# EAGLE board pro-base (EAGLE 9.6.2)
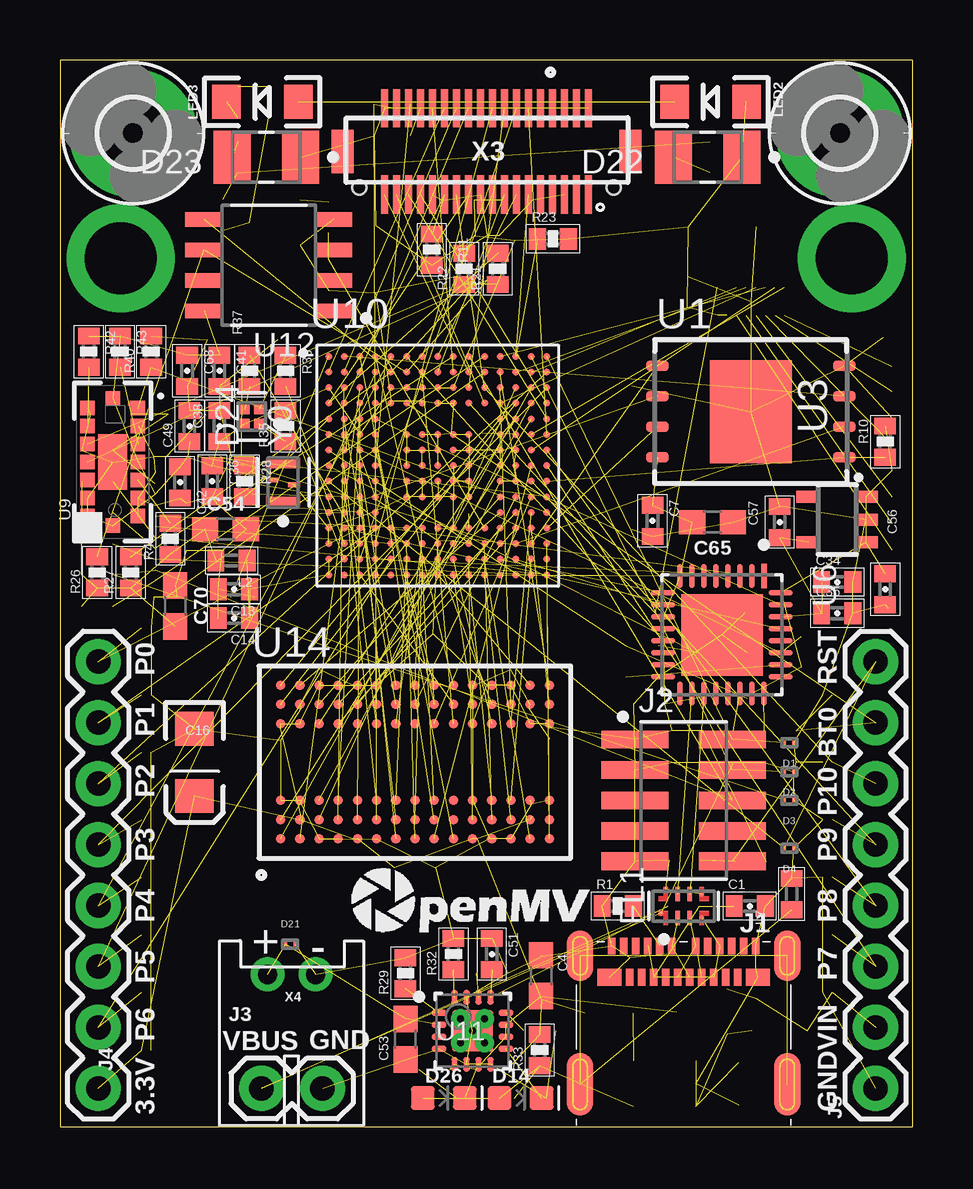
[diagram p2: board, top side]
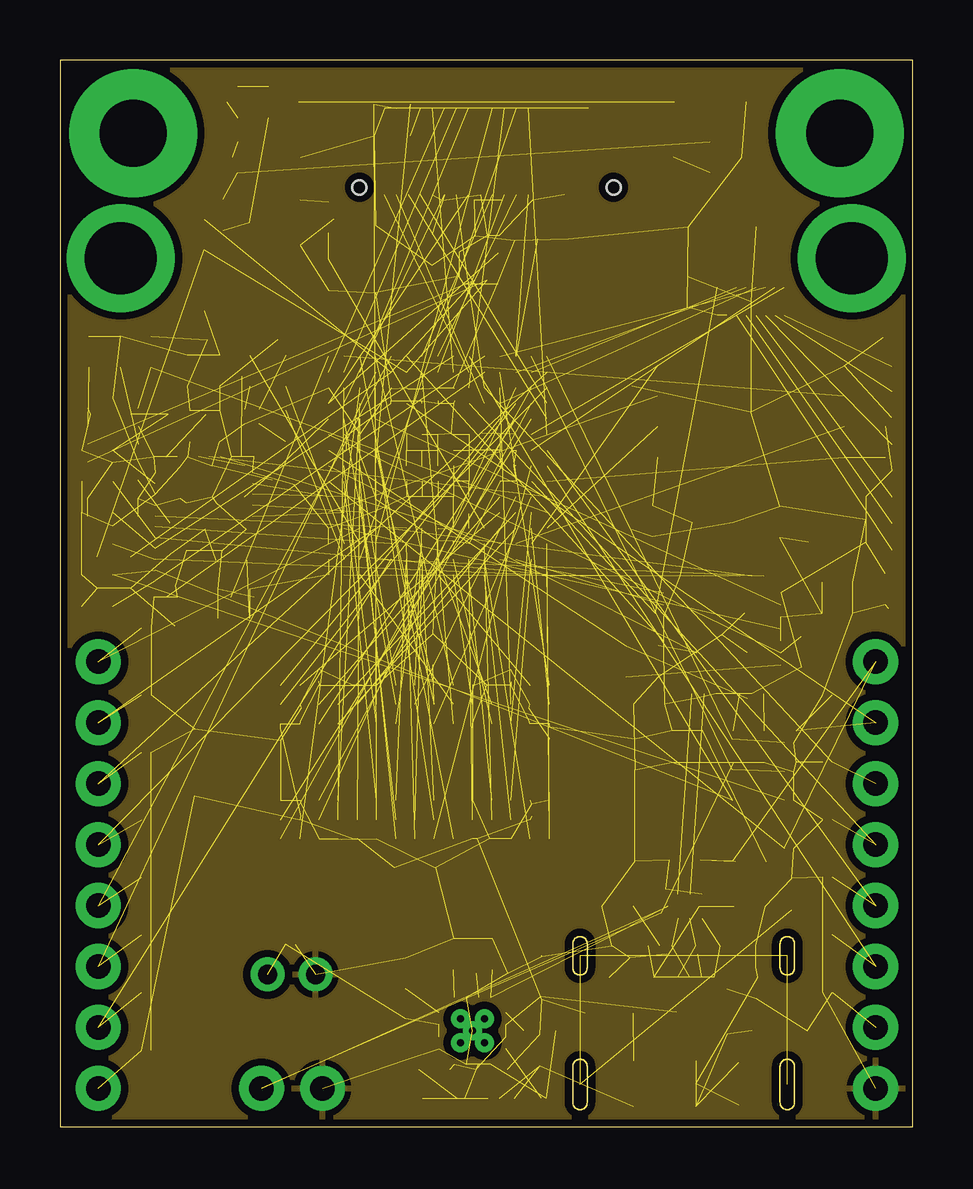
[diagram p3: board, inner layer GND]
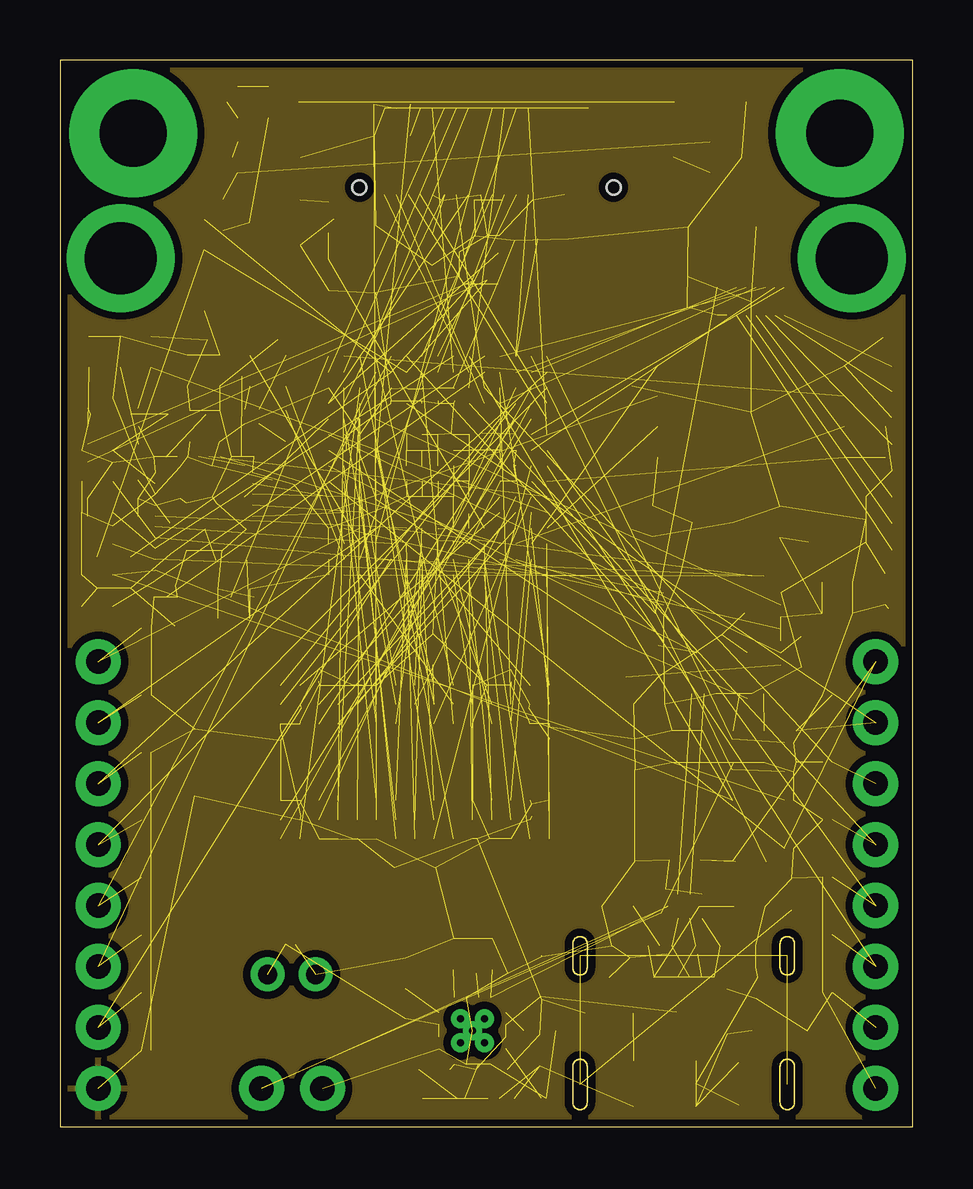
[diagram p4: board, inner layer VCC]
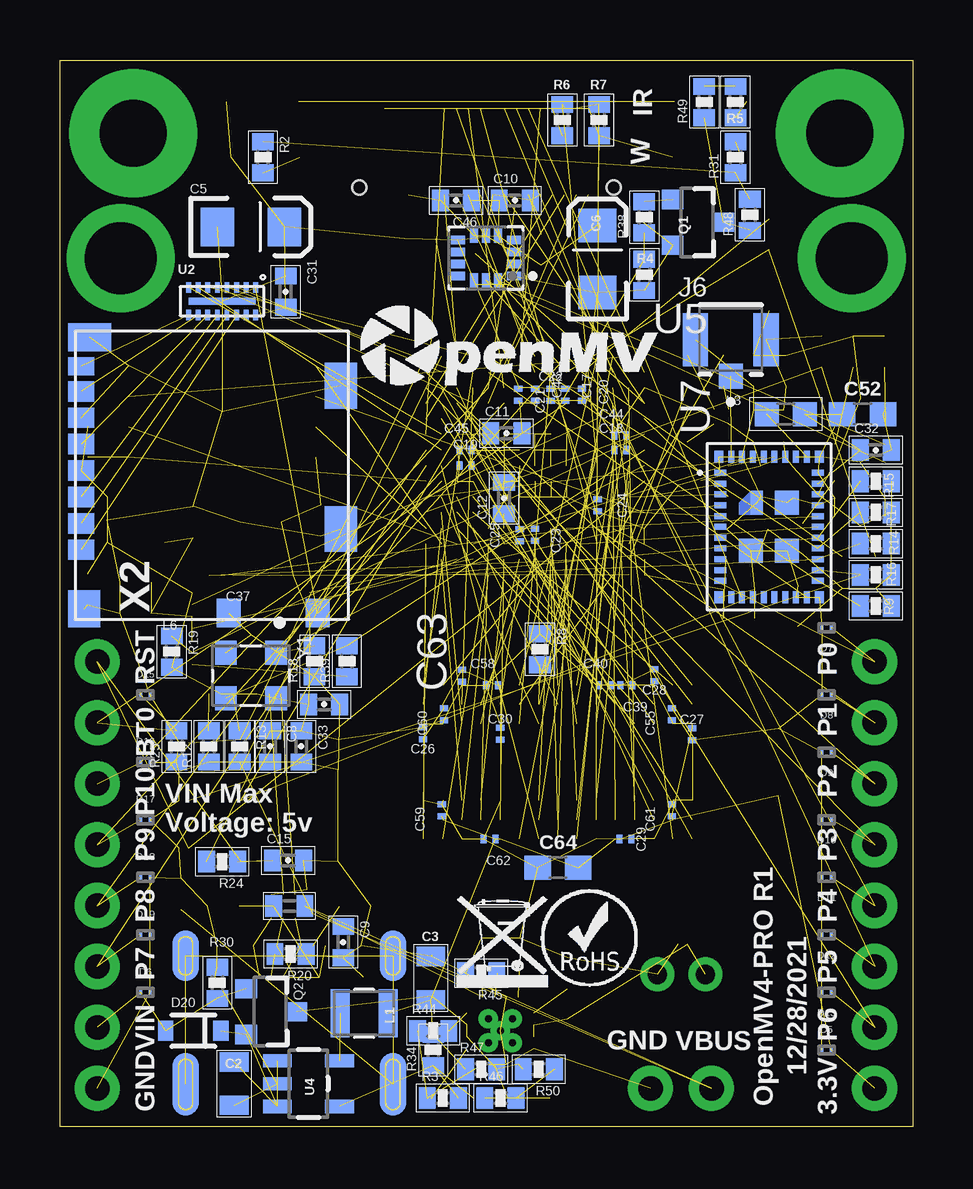
[diagram p5: board, bottom side, seen from below]

Size 35.56 x 44.45 mm. Coordinates in mm from the lower left corner, seen from the top.
Outline: 0,44.45 0,0 35.56,0 35.56,44.45 0,44.45
Copper layers (1+2*3+14*15+16): Top 0.035mm / dielectric 1.5mm / GND 0.035mm / dielectric 0.15mm / Route3 0.035mm / dielectric 0.2mm / Route14 0.035mm / dielectric 0.15mm / VCC 0.035mm / dielectric 0.2mm / Bottom 0.035mm
Design rules "default *": minimum track width 3.5mil, minimum drill 0.2mm, track to track 3.5mil, track to pad 5mil, pad to pad 5mil, via to via 5mil, smd to smd 3.5mil, copper to edge 5mil, drill to drill 10mil, minimum pad ring 10mil, minimum via ring 3mil, stop-mask expansion 2mil, vias tented up to drill 30mil, thermal gap 10mil
Net classes: 1 power: width 0.305 mm; 2 gnd: width 0.254 mm; 3 sdram_data: width 0.089 mm, drill 0.102 mm, clearance 0.089 mm; 4 sdram_cmd: width 0.089 mm, drill 0.102 mm, clearance 0.089 mm; 5 dcmi_data: width 0.089 mm, drill 0.102 mm, clearance 0.089 mm

## Footprints (pad centres in the part's own frame; a part is rotated, then mirrored left to right if it is on the bottom)
0402-CAP = smd 0.7 x 0.9: 1 -0.65,0; 2 0.65,0
0805 = smd 0.8 x 1.2: 1 -0.9,0; 2 0.9,0
0603 = smd 1.1 x 1: 1 -0.85,0; 2 0.85,0
EIA3216 = smd 1.4 x 1.6: A 1.4,0; C -1.4,0
C0201 = smd 0.25 x 0.35: 1 -0.25,0; 2 0.25,0
VISHAY_VCUT05E1-SD0-G4-08_0 = smd 0.14 x 0.24: 1 -0.2,0; 2 0.2,0
LED-0603 = smd 1 x 1: A -0.877,0; C 0.877,0
SOD-323 = smd 0.63 x 0.83: 1 -1.15,0; 2 1.15,0
CREE_CLM3C-WKW-CWBYA453_0 = smd 1.55 x 2.2: 1 -1.425,0; 2 1.425,0
CREE_UHD1110-FKA-CL1A13R3Q1BBQFMF3_0 = smd 0.4 x 0.4: 1 -0.3,0.3; 2 -0.3,-0.3; 3 0.3,-0.3; 4 0.3,0.3
STMICROELECTRONICS_ECMF02-4CMX8_0 = smd 0.18 x 0.18: 1 -0.3,0.95; 4 -0.5,-0.75; 5 0.5,-0.75; 8 0.7,0.75 | smd 0.6 x 0.2: 2 -0.5,0.25; 3 -0.5,-0.25; 6 0.5,-0.25; 7 0.5,0.25
2,8-PAD = drill 2.8 pad 5.334: B2,8 0,0
105450-0101 = smd 0.3 x 0.7: A1 -3,0.41; A2 -2.5,0.41; A3 -2,0.41; A4 -1.5,0.41; A5 -1,0.41; A6 -0.5,0.41; A7 0.5,0.41; A8 1,0.41; A9 1.5,0.41; A10 2,0.41; A11 2.5,0.41; A12 3,0.41; B2 2.25,-0.89; B3 1.75,-0.89; B4 1.25,-0.89; B5 0.75,-0.89; B6 0.25,-0.89; B7 -0.25,-0.89; B8 -0.75,-0.89; B9 -1.25,-0.89; B10 -1.75,-0.89; B11 -2.25,-0.89 | smd 1 x 0.7: B1 3.1,-0.89; B12 -3.1,-0.89 | smd 1.1 x 2.6 bottom: S_B1 -4.32,-5.36; S_B4 4.32,-5.36 | smd 1.1 x 2.1 bottom: S_B2 -4.32,0; S_B3 4.32,0 | smd 1.1 x 2.6: S_T1 -4.32,-5.36; S_T4 4.32,-5.36 | smd 1.1 x 2.1: S_T2 -4.32,0; S_T3 4.32,0
SAMTEC_FTSH-105-01-F-DV_0 = smd 0.74 x 2.79: 1 -2.54,-2.035; 2 -2.54,2.035; 3 -1.27,-2.035; 4 -1.27,2.035; 5 0,-2.035; 6 0,2.035; 7 1.27,-2.035; 8 1.27,2.035; 9 2.54,-2.035; 10 2.54,2.035
1X02 = drill 1.016 pad 1.88: 1 0,0; 2 2.54,0
1X08 = drill 1.016 pad 1.88: 1 0,0; 2 2.54,0; 3 5.08,0; 4 7.62,0; 5 10.16,0; 6 12.7,0; 7 15.24,0; 8 17.78,0
SAMTEC_RSP-122811-01 = smd 1 x 1.05: 1 0,-1.525 | smd 1.05 x 2.2: G1 -1.475,0; G2 1.475,0
1007 = smd 2 x 0.8: 1 0,1; 2 0,-1
C0402 = smd 0.7 x 0.9: 1 -0.65,0; 2 0.65,0
0603' = smd 1 x 1: 1 -0.8,0; 2 0.8,0
LED-1206 = smd 1.2 x 1.4: A -1.5,0; C 1.5,0
9774030151R = drill 3 pad 4.5: P$1 0,0
SOT23-3 = smd 0.8 x 0.9: 1 -0.95,-1; 2 0.95,-1; 3 0,1.1
0402-RES = smd 0.7 x 0.9: 1 -0.65,0; 2 0.65,0
SON127P800X600X80-9N = smd 0.94 x 0.44: 1 -3.895,1.905; 2 -3.895,0.635; 3 -3.895,-0.635; 4 -3.895,-1.905; 5 3.895,-1.905; 6 3.895,-0.635; 7 3.895,0.635; 8 3.895,1.905 | smd 3.4 x 4.3: 9 0,0
QFN3.5 = smd 2.8 x 0.3: GND 0,0 | smd 0.2 x 0.45: P$1 -1.4,-0.575; P$2 -1,-0.575; P$3 -0.6,-0.575; P$4 -0.2,-0.575; P$5 0.2,-0.575; P$6 0.6,-0.575; P$7 1,-0.575; P$8 1.4,-0.575; P$9 1.4,0.575; P$10 1,0.575; P$11 0.6,0.575; P$12 0.2,0.575; P$13 -0.2,0.575; P$14 -0.6,0.575; P$15 -1,0.575; P$16 -1.4,0.575
SOT23-5 = smd 0.5 x 1: 1 -0.95,-1.2; 2 0,-1.2; 3 0.95,-1.2; 4 0.95,1.2; 5 -0.95,1.2
TSOT25 = smd 0.55 x 1.2: 1 -0.95,-1.3; 2 0,-1.3; 3 0.95,-1.3; 4 0.95,1.3; 5 -0.95,1.3
PQFN50P300X250X86-14N = smd 0.58 x 0.35: 1 -1.175,0.75; 2 -1.175,0.25; 3 -1.175,-0.25; 4 -1.175,-0.75; 8 1.175,-0.75; 9 1.175,-0.25; 10 1.175,0.25; 11 1.175,0.75 | smd 0.35 x 0.58: 5 -0.5,-0.925; 6 0,-0.925; 7 0.5,-0.925; 12 0.5,0.925; 13 0,0.925; 14 -0.5,0.925
MICROCHIP_USB3320C-EZK-TR_1 = smd 1.01 x 0.239: 1 -2.451,1.75; 2 -2.451,1.25; 3 -2.451,0.75; 4 -2.451,0.25; 5 -2.451,-0.25; 6 -2.451,-0.75; 7 -2.451,-1.25; 8 -2.451,-1.75; 17 2.451,-1.75; 18 2.451,-1.25; 19 2.451,-0.75; 20 2.451,-0.25; 21 2.451,0.25; 22 2.451,0.75; 23 2.451,1.25; 24 2.451,1.75 | smd 0.239 x 1.01: 9 -1.75,-2.451; 10 -1.25,-2.451; 11 -0.75,-2.451; 12 -0.25,-2.451; 13 0.25,-2.451; 14 0.75,-2.451; 15 1.25,-2.451; 16 1.75,-2.451; 25 1.75,2.451; 26 1.25,2.451; 27 0.75,2.451; 28 0.25,2.451; 29 -0.25,2.451; 30 -0.75,2.451; 31 -1.25,2.451; 32 -1.75,2.451 | smd 3.4 x 3.4: 33 0,0
XCVR_LBEE5KL1DX-TEMP = smd 0.5 x 0.25: 1 -2.025,2.25; 2 -2.025,1.8; 3 -2.025,1.35; 4 -2.025,0.9; 5 -2.025,0.45; 6 -2.025,0; 7 -2.025,-0.45; 8 -2.025,-0.9; 9 -2.025,-1.35; 10 -2.025,-1.8; 11 -2.025,-2.25; 22 2.025,-2.25; 23 2.025,-1.8; 24 2.025,-1.35; 25 2.025,-0.9; 26 2.025,-0.45; 27 2.025,0; 28 2.025,0.45; 29 2.025,0.9; 30 2.025,1.35; 31 2.025,1.8; 32 2.025,2.25 | smd 0.375 x 0.5: 12 -2.087,-2.925; 21 2.087,-2.925; 33 2.087,2.925; 42 -2.087,2.925 | smd 0.25 x 0.5: 13 -1.575,-2.925; 14 -1.125,-2.925; 15 -0.675,-2.925; 16 -0.225,-2.925; 17 0.225,-2.925; 18 0.675,-2.925; 19 1.125,-2.925; 20 1.575,-2.925; 34 1.575,2.925; 35 1.125,2.925; 36 0.675,2.925; 37 0.225,2.925; 38 -0.225,2.925; 39 -0.675,2.925; 40 -1.125,2.925; 41 -1.575,2.925 | smd 0.5 x 1: 43 -0.5,1 | smd 1 x 1: 44 -0.75,-1; 45 0.75,1; 46 0.75,-1
VL53L5CX = smd 0.6 x 0.6: A1 2.25,-1.05; A2 1.5,-1.05; A3 0.75,-1.05; A4 0,-1.05; A5 -0.75,-1.05; A6 -1.5,-1.05; A7 -2.25,-1.05; B1 2.65,0; B7 -2.65,0; C1 2.25,1.05; C2 1.5,1.05; C3 0.75,1.05; C4 0,1.05; C5 -0.75,1.05; C6 -1.5,1.05; C7 -2.25,1.05 | smd 2.316 x 1.2: B4 0,0
UFGBGA-176 = smd 0.3 x 0.3: A1 -4.55,4.55; A2 -3.9,4.55; A3 -3.25,4.55; A4 -2.6,4.55; A5 -1.95,4.55; A6 -1.3,4.55; A7 -0.65,4.55; A8 0,4.55; A9 0.65,4.55; A10 1.3,4.55; A11 1.95,4.55; A12 2.6,4.55; A13 3.25,4.55; A14 3.9,4.55; A15 4.55,4.55; B1 -4.55,3.9; B2 -3.9,3.9; B3 -3.25,3.9; B4 -2.6,3.9; B5 -1.95,3.9; B6 -1.3,3.9; B7 -0.65,3.9; B8 0,3.9; B9 0.65,3.9; B10 1.3,3.9; B11 1.95,3.9; B12 2.6,3.9; B13 3.25,3.9; B14 3.9,3.9; B15 4.55,3.9; C1 -4.55,3.25; C2 -3.9,3.25; C3 -3.25,3.25; C4 -2.6,3.25; C5 -1.95,3.25; C6 -1.3,3.25; C7 -0.65,3.25; C8 0,3.25; C9 0.65,3.25; C10 1.3,3.25; C11 1.95,3.25; C12 2.6,3.25; C13 3.25,3.25; C14 3.9,3.25; C15 4.55,3.25; D1 -4.55,2.6; D2 -3.9,2.6; D3 -3.25,2.6; D4 -2.6,2.6; D5 -1.95,2.6; D6 -1.3,2.6; D7 -0.65,2.6; D8 0,2.6; D9 0.65,2.6; D10 1.3,2.6; D11 1.95,2.6; D12 2.6,2.6; D13 3.25,2.6; D14 3.9,2.6; D15 4.55,2.6; E1 -4.55,1.95; E2 -3.9,1.95; E3 -3.25,1.95; E4 -2.6,1.95; E12 2.6,1.95; E13 3.25,1.95; E14 3.9,1.95; E15 4.55,1.95; F1 -4.55,1.3; F2 -3.9,1.3; F3 -3.25,1.3; F4 -2.6,1.3; F6 -1.3,1.3; F7 -0.65,1.3; F8 0,1.3; F9 0.65,1.3; F10 1.3,1.3; F12 2.6,1.3; F13 3.25,1.3; F14 3.9,1.3; F15 4.55,1.3; G1 -4.55,0.65; G2 -3.9,0.65; G3 -3.25,0.65; G4 -2.6,0.65; G6 -1.3,0.65; G7 -0.65,0.65; G8 0,0.65; G9 0.65,0.65; G10 1.3,0.65; G12 2.6,0.65; G13 3.25,0.65; G14 3.9,0.65; G15 4.55,0.65; H1 -4.55,0; H2 -3.9,0; H3 -3.25,0; H4 -2.6,0; H6 -1.3,0; H7 -0.65,0; H8 0,0; H9 0.65,0; H10 1.3,0; H12 2.6,0; H13 3.25,0; H14 3.9,0; H15 4.55,0; J1 -4.55,-0.65; J2 -3.9,-0.65; J3 -3.25,-0.65; J4 -2.6,-0.65; J6 -1.3,-0.65; J7 -0.65,-0.65; J8 0,-0.65; J9 0.65,-0.65; J10 1.3,-0.65; J12 2.6,-0.65; J13 3.25,-0.65; J14 3.9,-0.65; J15 4.55,-0.65; K1 -4.55,-1.3; K2 -3.9,-1.3; K3 -3.25,-1.3; K4 -2.6,-1.3; K6 -1.3,-1.3; K7 -0.65,-1.3; K8 0,-1.3; K9 0.65,-1.3; K10 1.3,-1.3; K12 2.6,-1.3; K13 3.25,-1.3; K14 3.9,-1.3; K15 4.55,-1.3; L1 -4.55,-1.95; L2 -3.9,-1.95; L3 -3.25,-1.95; L4 -2.6,-1.95; L12 2.6,-1.95; L13 3.25,-1.95; L14 3.9,-1.95; L15 4.55,-1.95; M1 -4.55,-2.6; M2 -3.9,-2.6; M3 -3.25,-2.6; M4 -2.6,-2.6; M5 -1.95,-2.6; M6 -1.3,-2.6; M7 -0.65,-2.6; M8 0,-2.6; M9 0.65,-2.6; M10 1.3,-2.6; M11 1.95,-2.6; M12 2.6,-2.6; M13 3.25,-2.6; M14 3.9,-2.6; M15 4.55,-2.6; N1 -4.55,-3.25; N2 -3.9,-3.25; N3 -3.25,-3.25; N4 -2.6,-3.25; N5 -1.95,-3.25; N6 -1.3,-3.25; N7 -0.65,-3.25; N8 0,-3.25; N9 0.65,-3.25; N10 1.3,-3.25; N11 1.95,-3.25; N12 2.6,-3.25; N13 3.25,-3.25; N14 3.9,-3.25; N15 4.55,-3.25; P1 -4.55,-3.9; P2 -3.9,-3.9; P3 -3.25,-3.9; P4 -2.6,-3.9; P5 -1.95,-3.9; P6 -1.3,-3.9; P7 -0.65,-3.9; P8 0,-3.9; P9 0.65,-3.9; P10 1.3,-3.9; P11 1.95,-3.9; P12 2.6,-3.9; P13 3.25,-3.9; P14 3.9,-3.9; P15 4.55,-3.9; R1 -4.55,-4.55; R2 -3.9,-4.55; R3 -3.25,-4.55; R4 -2.6,-4.55; R5 -1.95,-4.55; R6 -1.3,-4.55; R7 -0.65,-4.55; R8 0,-4.55; R9 0.65,-4.55; R10 1.3,-4.55; R11 1.95,-4.55; R12 2.6,-4.55; R13 3.25,-4.55; R14 3.9,-4.55; R15 4.55,-4.55
TEXAS_INSTRUMENTS_BQ24072TRGTR_0 = smd 0.6 x 0.25: 1 -1.4,0.75; 2 -1.4,0.25; 3 -1.4,-0.25; 4 -1.4,-0.75; 9 1.4,-0.75; 10 1.4,-0.25; 11 1.4,0.25; 12 1.4,0.75 | smd 0.25 x 0.6: 5 -0.75,-1.4; 6 -0.25,-1.4; 7 0.25,-1.4; 8 0.75,-1.4; 13 0.75,1.4; 14 0.25,1.4; 15 -0.25,1.4; 16 -0.75,1.4 | smd 1.7 x 1.7: 17 0,0 | smd 1.55 x 1.55: 17-2 0,0 | drill 0.3 pad 0.5: PAD_1 0,0; PAD_2 0.5,-0.5; PAD_3 0.5,0.5; PAD_4 -0.5,0.5; PAD_5 -0.5,-0.5
MICROCHIP_ATECC608A-SSHDA-B_0 = smd 1.55 x 0.6: 1 -2.7,1.905; 2 -2.7,0.635; 3 -2.7,-0.635; 4 -2.7,-1.905; 5 2.7,-1.905; 6 2.7,-0.635; 7 2.7,0.635; 8 2.7,1.905
BGA90 = smd 0.4 x 0.4: A1 -3.2,5.6; A2 -2.4,5.6; A3 -1.6,5.6; A7 1.6,5.6; A8 2.4,5.6; A9 3.2,5.6; B1 -3.2,4.8; B2 -2.4,4.8; B3 -1.6,4.8; B7 1.6,4.8; B8 2.4,4.8; B9 3.2,4.8; C1 -3.2,4; C2 -2.4,4; C3 -1.6,4; C7 1.6,4; C8 2.4,4; C9 3.2,4; D1 -3.2,3.2; D2 -2.4,3.2; D3 -1.6,3.2; D7 1.6,3.2; D8 2.4,3.2; D9 3.2,3.2; E1 -3.2,2.4; E2 -2.4,2.4; E3 -1.6,2.4; E7 1.6,2.4; E8 2.4,2.4; E9 3.2,2.4; F1 -3.2,1.6; F2 -2.4,1.6; F3 -1.6,1.6; F7 1.6,1.6; F8 2.4,1.6; F9 3.2,1.6; G1 -3.2,0.8; G2 -2.4,0.8; G3 -1.6,0.8; G7 1.6,0.8; G8 2.4,0.8; G9 3.2,0.8; H1 -3.2,0; H2 -2.4,0; H3 -1.6,0; H7 1.6,0; H8 2.4,0; H9 3.2,0; J1 -3.2,-0.8; J2 -2.4,-0.8; J3 -1.6,-0.8; J7 1.6,-0.8; J8 2.4,-0.8; J9 3.2,-0.8; K1 -3.2,-1.6; K2 -2.4,-1.6; K3 -1.6,-1.6; K7 1.6,-1.6; K8 2.4,-1.6; K9 3.2,-1.6; L1 -3.2,-2.4; L2 -2.4,-2.4; L3 -1.6,-2.4; L7 1.6,-2.4; L8 2.4,-2.4; L9 3.2,-2.4; M1 -3.2,-3.2; M2 -2.4,-3.2; M3 -1.6,-3.2; M7 1.6,-3.2; M8 2.4,-3.2; M9 3.2,-3.2; N1 -3.2,-4; N2 -2.4,-4; N3 -1.6,-4; N7 1.6,-4; N8 2.4,-4; N9 3.2,-4; P1 -3.2,-4.8; P2 -2.4,-4.8; P3 -1.6,-4.8; P7 1.6,-4.8; P8 2.4,-4.8; P9 3.2,-4.8; R1 -3.2,-5.6; R2 -2.4,-5.6; R3 -1.6,-5.6; R7 1.6,-5.6; R8 2.4,-5.6; R9 3.2,-5.6
1040310811 = smd 1.2 x 1: CD$1 11.74,10.1; CD$2 11.74,6.4 | smd 1.55 x 1.35: G$1 11.565,0.375 | smd 1.17 x 1.8: G$2 0.245,0.6 | smd 1.9 x 1.35: G$3 2.27,11.075; G$4 8.24,11.075 | smd 0.85 x 1.1: P$1 9.105,0.25; P$2 8.005,0.25; P$3 6.905,0.25; P$4 5.805,0.25; P$5 4.705,0.25; P$6 3.605,0.25; P$7 2.505,0.25 | smd 0.75 x 1.1: P$8 1.455,0.25
DF12-36-DS = smd 0.3 x 1.6: 1 4.25,-1.8; 2 4.25,1.8; 3 3.75,-1.8; 4 3.75,1.8; 5 3.25,-1.8; 6 3.25,1.8; 7 2.75,-1.8; 8 2.75,1.8; 9 2.25,-1.8; 10 2.25,1.8; 11 1.75,-1.8; 12 1.75,1.8; 13 1.25,-1.8; 14 1.25,1.8; 15 0.75,-1.8; 16 0.75,1.8; 17 0.25,-1.8; 18 0.25,1.8; 19 -0.25,-1.8; 20 -0.25,1.8; 21 -0.75,-1.8; 22 -0.75,1.8; 23 -1.25,-1.8; 24 -1.25,1.8; 25 -1.75,-1.8; 26 -1.75,1.8; 27 -2.25,-1.8; 28 -2.25,1.8; 29 -2.75,-1.8; 30 -2.75,1.8; 31 -3.25,-1.8; 32 -3.25,1.8; 33 -3.75,-1.8; 34 -3.75,1.8; 35 -4.25,-1.8; 36 -4.25,1.8 | smd 0.9 x 1.8: F1 6,0; F2 -6,0 | hole 0.6: 5.3,-1.5; -5.3,-1.5
JST-PH-2-THM-RA = drill 0.8 pad 1.422: 1 1,0; 2 -1,0
SITIME_SIT1533AI-H4-DCC-32.768E_0 = smd 0.4 x 1.4: 1 -0.8,0; 3 0.8,0 | smd 0.2 x 0.5: 2 -0.1,-0.45; 4 0.1,0.45
OSC_DSC6083CI2A-032K768 = smd 1 x 0.9: 1 -0.95,1.05; 2 -0.95,-1.05; 3 0.95,-1.05; 4 0.95,1.05

## Placement (x,y rotation side)
C1  0.1uF  [0402-CAP]  28.75,9.2 0 top
C2  22uF  [0805]  28.3,1.8 90 bottom
C3  22uF  [0805]  20.1,6.2 270 bottom
C4  4.7uF  [0603]  20.05,6.3 270 top
C5  47uF  [EIA3216]  27.6,37.5 0 bottom
C6  47uF  [EIA3216]  13.15,36.16 90 bottom
C7  0.1uF  [0402-CAP]  24.7,25.25 270 top
C8  0.1uF  [0402-CAP]  26.8,15.85 270 bottom
C9  0.1uF  [0402-CAP]  23.75,7.7 270 bottom
C10  0.1uF  [0402-CAP]  16.6,38.6 0 bottom
C11  2.2uF  [0402-CAP]  16.95,28.9 0 bottom
C12  2.2uF  [0402-CAP]  17.05,26.2 90 bottom
C13  1uF  [0402-CAP]  7.25,22.4 180 top
C14  0.1uF  [0402-CAP]  7.25,21.2 180 top
C15  1uF  [0402-CAP]  26.05,11.1 0 bottom
C16  47uF  [EIA3216]  5.61,15.19 270 top
C17  0.1uF  [C0201]  14.5,30.5 270 bottom
C18  0.1uF  [C0201]  12.2,28.2 0 bottom
C19  0.1uF  [C0201]  18.65,27.55 0 bottom
C20  0.1uF  [C0201]  13.8,30.5 270 bottom
C21  0.1uF  [C0201]  16.45,30.5 270 bottom
C22  0.1uF  [C0201]  15.1,30.5 270 bottom
C23  0.1uF  [C0201]  15.76,24.68 90 bottom
C24  0.1uF  [C0201]  13.15,25.9 270 bottom
C25  0.1uF  [C0201]  16.4,24.64 90 bottom
C26  0.1uF  [C0201]  20.43,16.39 270 bottom
C27  0.1uF  [C0201]  9.2,16.35 270 bottom
C28  0.1uF  [C0201]  10.78,18.82 90 bottom
C29  0.1uF  [C0201]  11.98,11.99 0 bottom
C30  0.1uF  [C0201]  17.2,16.37 270 bottom
C31  0.1uF  [0402-CAP]  26.15,34.8 90 bottom
C32  0.1uF  [0402-CAP]  1.55,28.2 0 bottom
C33  0.1uF  [0402-CAP]  25.5,15.85 270 bottom
C34  0.1uF  [0402-CAP]  32.4,22.7 0 top
C35  0.1uF  [0402-CAP]  32.4,21.4 0 top
C36  0.1uF  [0402-CAP]  6.35,26.9 270 top
C37  0.1uF  [0402-CAP]  24.55,17.6 0 bottom
C38  2.2uF  [0402-CAP]  6.65,29.2 90 top
C39  0.1uF  [C0201]  11.95,18.4 180 bottom
C40  0.1uF  [C0201]  12.85,18.4 0 bottom
C41  0.1uF  [0402-CAP]  6.65,31.5 270 top
C42  0.1uF  [0402-CAP]  5,26.85 270 top
C43  0.1uF  [C0201]  15.75,30.5 270 bottom
C44  0.1uF  [C0201]  12.2,28.8 0 bottom
C45  0.1uF  [C0201]  18.65,28.2 0 bottom
C46  0.1uF  [0402-CAP]  19.05,38.6 180 bottom
C49  0.1uF  [0402-CAP]  5.4,29.2 90 top
C51  1uF  [0402-CAP]  18,7.2 270 top
C52  4.7uF  [0603]  2.1,29.7 0 bottom
C53  4.7uF  [0603]  14.4,3.65 90 top
C54  4.7uF  [0603]  6.9,24.9 0 top
C55  0.1uF  [C0201]  10.05,17.2 90 bottom
C56  1uF  [0402-CAP]  34.4,22.4 90 top
C57  1uF  [0402-CAP]  30,25.2 270 top
C58  0.1uF  [C0201]  17.55,18.4 0 bottom
C59  0.1uF  [C0201]  19.65,13.2 90 bottom
C60  0.1uF  [C0201]  19.55,17.2 90 bottom
C61  0.1uF  [C0201]  10.05,13.2 90 bottom
C62  0.1uF  [C0201]  17.65,12 180 bottom
C63  0.1uF  [C0201]  18.8,18.8 90 bottom
C64  4.7uF  [0603]  14.8,10.8 0 bottom
C65  4.7uF  [0603]  27.2,25.2 180 top
C68  0.1uF  [0402-CAP]  5.3,31.5 270 top
C70  4.7uF  [0603]  4.8,21.7 270 top
D1  VISHAY_VCUT05E1-SD0-G4-08VISHAY_VCUT05E1-SD0-G4-08_0_0  [VISHAY_VCUT05E1-SD0-G4-08_0]  30.4,16 180 top
D2  VISHAY_VCUT05E1-SD0-G4-08VISHAY_VCUT05E1-SD0-G4-08_0_0  [VISHAY_VCUT05E1-SD0-G4-08_0]  30.4,14.8 180 top
D3  VISHAY_VCUT05E1-SD0-G4-08VISHAY_VCUT05E1-SD0-G4-08_0_0  [VISHAY_VCUT05E1-SD0-G4-08_0]  30.4,13.6 180 top
D4  VISHAY_VCUT05E1-SD0-G4-08VISHAY_VCUT05E1-SD0-G4-08_0_0  [VISHAY_VCUT05E1-SD0-G4-08_0]  30.4,11.6 180 top
D5  VISHAY_VCUT05E1-SD0-G4-08VISHAY_VCUT05E1-SD0-G4-08_0_0  [VISHAY_VCUT05E1-SD0-G4-08_0]  3.6,3.2 0 bottom
D6  VISHAY_VCUT05E1-SD0-G4-08VISHAY_VCUT05E1-SD0-G4-08_0_0  [VISHAY_VCUT05E1-SD0-G4-08_0]  32,5.6 0 bottom
D7  VISHAY_VCUT05E1-SD0-G4-08VISHAY_VCUT05E1-SD0-G4-08_0_0  [VISHAY_VCUT05E1-SD0-G4-08_0]  3.6,20.8 180 bottom
D8  VISHAY_VCUT05E1-SD0-G4-08VISHAY_VCUT05E1-SD0-G4-08_0_0  [VISHAY_VCUT05E1-SD0-G4-08_0]  3.6,18 180 bottom
D9  VISHAY_VCUT05E1-SD0-G4-08VISHAY_VCUT05E1-SD0-G4-08_0_0  [VISHAY_VCUT05E1-SD0-G4-08_0]  3.6,15.6 180 bottom
D10  VISHAY_VCUT05E1-SD0-G4-08VISHAY_VCUT05E1-SD0-G4-08_0_0  [VISHAY_VCUT05E1-SD0-G4-08_0]  3.6,12.8 180 bottom
D11  VISHAY_VCUT05E1-SD0-G4-08VISHAY_VCUT05E1-SD0-G4-08_0_0  [VISHAY_VCUT05E1-SD0-G4-08_0]  3.6,10.4 180 bottom
D12  VISHAY_VCUT05E1-SD0-G4-08VISHAY_VCUT05E1-SD0-G4-08_0_0  [VISHAY_VCUT05E1-SD0-G4-08_0]  3.6,8 180 bottom
D13  VISHAY_VCUT05E1-SD0-G4-08VISHAY_VCUT05E1-SD0-G4-08_0_0  [VISHAY_VCUT05E1-SD0-G4-08_0]  3.6,5.6 180 bottom
D14  RED (SML-D12V1WT86)  [LED-0603]  19.2,1.2 0 top
D15  VISHAY_VCUT05E1-SD0-G4-08VISHAY_VCUT05E1-SD0-G4-08_0_0  [VISHAY_VCUT05E1-SD0-G4-08_0]  32,18 0 bottom
D16  VISHAY_VCUT05E1-SD0-G4-08VISHAY_VCUT05E1-SD0-G4-08_0_0  [VISHAY_VCUT05E1-SD0-G4-08_0]  32,15.2 0 bottom
D17  VISHAY_VCUT05E1-SD0-G4-08VISHAY_VCUT05E1-SD0-G4-08_0_0  [VISHAY_VCUT05E1-SD0-G4-08_0]  32,12.8 0 bottom
D18  VISHAY_VCUT05E1-SD0-G4-08VISHAY_VCUT05E1-SD0-G4-08_0_0  [VISHAY_VCUT05E1-SD0-G4-08_0]  32,10.4 0 bottom
D19  VISHAY_VCUT05E1-SD0-G4-08VISHAY_VCUT05E1-SD0-G4-08_0_0  [VISHAY_VCUT05E1-SD0-G4-08_0]  32,8 0 bottom
D20  BAT60BE6327  [SOD-323]  30,4 180 bottom
D21  VISHAY_VCUT05E1-SD0-G4-08VISHAY_VCUT05E1-SD0-G4-08_0_0  [VISHAY_VCUT05E1-SD0-G4-08_0]  9.6,7.6 0 top
D22  CREE_CLM3C-WKW-CWBYA453CREE_CLM3C-WKW-CWBYA453_0_0  [CREE_CLM3C-WKW-CWBYA453_0]  27,40.4 180 top
D23  CREE_CLM3C-WKW-CWBYA453CREE_CLM3C-WKW-CWBYA453_0_0  [CREE_CLM3C-WKW-CWBYA453_0]  8.6,40.4 180 top
D24  CREE_UHD1110-FKA-CL1A13R3Q1BBQFMF3CREE_UHD1110-FKA-CL1A13R3Q1BBQFMF3_0_0  [CREE_UHD1110-FKA-CL1A13R3Q1BBQFMF3_0]  8,29.6 180 top
D26  GREEN  [LED-0603]  16,1.2 0 top
FL1  STMICROELECTRONICS_ECMF02-4CMX8STMICROELECTRONICS_ECMF02-4CMX8_0_0  [STMICROELECTRONICS_ECMF02-4CMX8_0]  26,9.2 90 top
H1  MOUNT-PAD-ROUND2.8  [2,8-PAD]  3.05,41.4 90 top
H2  MOUNT-PAD-ROUND2.8  [2,8-PAD]  32.51,41.4 270 top
J1  [105450-0101]  26,7.12 0 top
J2  SAMTEC_FTSH-105-01-F-DVSAMTEC_FTSH-105-01-F-DV_0_0  [SAMTEC_FTSH-105-01-F-DV_0]  26,13.6 270 top
J3  [1X02]  8.4,1.6 0 top
J4  [1X08]  1.6,1.6 90 top
J5  [1X08]  34,1.6 90 top
J6  RSP-122811-01  [SAMTEC_RSP-122811-01]  7.6,32.8 0 bottom
L1  4.7uH/1.4A  [1007]  22.89,4.73 90 bottom
L2  MPZ1608S181ATAH0  [C0402]  7.15,23.6 180 top
L3  LQM18PN2R2MGHD  [0603']  5.3,29.7 0 bottom
L6  MPZ1608S101ATAH0  [C0402]  26,9.2 0 bottom
L7  MPZ1608S101ATAH0  [C0402]  30.5,9.7 90 top
LED2  VSMY12850  [LED-1206]  27.12,42.71 180 top
LED3  VSMY12850  [LED-1206]  8.44,42.71 180 top
M1  9774030243R  [9774030151R]  2.54,36.2 0 top
M2  9774030243R  [9774030151R]  33.02,36.2 0 top
Q1  BSS138  [SOT23-3]  9.01,37.68 270 bottom
Q2  AO3401  [SOT23-3]  26.8,4.8 270 bottom
R1  5.1K  [0402-RES]  23.25,9.2 0 top
R2  10R  [0402-RES]  27.1,40.4 270 bottom
R3  100K  [0402-RES]  19.6,1.2 0 bottom
R4  100K  [0402-RES]  11.2,35.5 90 bottom
R5  10R  [0402-RES]  7.4,42.7 270 bottom
R6  4.7K  [0402-RES]  14.62,41.95 90 bottom
R7  4.7K  [0402-RES]  13.09,41.95 90 bottom
R8  100K  [0402-RES]  15.55,19.9 270 bottom
R9  100K  [0402-RES]  1.55,21.7 0 bottom
R10  100K  [0402-RES]  34.4,28.55 90 top
R11  100K  [0402-RES]  15.5,36.55 270 top
R12  8.06K  [0402-RES]  29.36,15.85 90 bottom
R13  10K  [0402-RES]  28.07,15.85 270 bottom
R14  100K  [0402-RES]  1.55,24.3 0 bottom
R15  100K  [0402-RES]  1.55,26.9 0 bottom
R16  100K  [0402-RES]  1.55,23 0 bottom
R17  100K  [0402-RES]  1.55,25.6 0 bottom
R18  100K  [0402-RES]  24.95,19.4 90 bottom
R19  100K  [0402-RES]  30.9,19.8 270 bottom
R20  5.1K  [0402-RES]  25.95,7.2 180 bottom
R21  100K  [0402-RES]  18.25,35.75 90 top
R22  100K  [0402-RES]  16.85,35.75 90 top
R23  100K  [0402-RES]  20.55,37 0 top
R24  10K  [0402-RES]  28.8,11.05 180 bottom
R25  100K  [0402-RES]  30.7,15.85 90 bottom
R26  4.7K  [0402-RES]  1.55,23.1 90 top
R27  4.7K  [0402-RES]  2.95,23.1 90 top
R28  0  [0402-RES]  7.7,26.9 270 top
R29  10K  [0402-RES]  14.4,6.4 90 top
R30  100K  [0402-RES]  29,6 270 bottom
R31  10R  [0402-RES]  7.4,40.4 90 bottom
R32  1.13K  [0402-RES]  16.4,7.2 90 top
R33  1.5K  [0402-RES]  20,3.2 90 top
R34  435K  [0402-RES]  20,3.2 90 bottom
R35  220  [0402-RES]  9.4,29.2 90 top
R36  220  [0402-RES]  9.4,31.5 270 top
R37  220  [0402-RES]  7.9,31.5 90 top
R38  220  [0402-RES]  11.2,37.9 90 bottom
R39  0  [0402-RES]  23.6,19.4 90 bottom
R40  47K  [0402-RES]  3.8,32.3 90 top
R41  47K  [0402-RES]  4.6,24.5 90 top
R42  47K  [0402-RES]  1.2,32.3 270 top
R43  47K  [0402-RES]  2.5,32.3 270 top
R44  1.18K  [0402-RES]  20,4 0 bottom
R45  46.4K  [0402-RES]  18,6.4 180 bottom
R46  1.5K  [0402-RES]  17.2,1.2 0 bottom
R47  0R  [0402-RES]  18,2.4 0 bottom
R48  0R (DNP)  [0402-RES]  6.8,38 90 bottom
R49  0R  [0402-RES]  8.7,42.7 90 bottom
R50  0R  [0402-RES]  15.6,2.4 180 bottom
U1  W25Q256JVEIQ_TR  [SON127P800X600X80-9N]  28.8,29.8 180 top
U2  EMIF06-MSD02N16  [QFN3.5]  28.8,34.4 180 bottom
U3  ME6211C18M5G  [SOT23-5]  32.4,25.3 90 top
U4  PAM2305AABADJ  [TSOT25]  25.2,1.8 270 bottom
U5  LSM6DS3TR-C  [PQFN50P300X250X86-14N]  17.8,36.2 180 bottom
U6  MICROCHIP_USB3320C-EZK-TRMICROCHIP_USB3320C-EZK-TR_0_1  [MICROCHIP_USB3320C-EZK-TR_1]  27.6,20.5 270 top
U7  LBEE5KL1DX-TEMP  [XCVR_LBEE5KL1DX-TEMP]  6,25 0 bottom
U9  VL53L5CX  [VL53L5CX]  2.2,27.7 90 top
U10  STM32H743IIK6  [UFGBGA-176]  15.75,27.55 0 top
U11  TEXAS_INSTRUMENTS_BQ24072TRGTRTEXAS_INSTRUMENTS_BQ24072TRGTR_0_0  [TEXAS_INSTRUMENTS_BQ24072TRGTR_0]  17.2,4 0 top
U12  MICROCHIP_ATECC608A-SSHDA-BMICROCHIP_ATECC608A-SSHDA-B_0_0  [MICROCHIP_ATECC608A-SSHDA-B_0]  8.7,35.9 180 top
U14  IS42S32800  [BGA90]  14.8,15.2 90 top
U$1  [WEEE]  19.02,5.83 0 bottom
U$2  [ROHS]  15.51,5.85 0 bottom
U$3  [OMV-LOGO]  23.18,30.69 0 bottom
U$4  [OMV-LOGO-SMALL]  12.05,7.95 0 top
X2  USD-1040310811  [1040310811]  34.92,33.15 270 bottom
X3  DF12-36-DS  [DF12-36-DS]  17.78,40.64 0 top
X4  S2B-PH-K-S(LF)(SN)  [JST-PH-2-THM-RA]  9.65,6.35 180 top
Y0  SITIME_SIT1533AI-H4-DCC-32.768ESITIME_SIT1533AI-H4-DCC-32.768E_0_0  [SITIME_SIT1533AI-H4-DCC-32.768E_0]  9.3,26.85 90 top
Y1  DSC1001BI1-024.0000  [OSC_DSC6083CI2A-032K768]  27.6,18.8 270 bottom

## Tracks (layer width: path | path; a pad name or v marks a point on that pad's centre or on a via)
1.8V  (5 unrouted)
24MHZ_CLK  (2 unrouted)
32.768KHZ_CLK  (2 unrouted)
ADC  (2 unrouted)
ANT_PI_I  (1 unrouted)
BAT  (4 unrouted)
BOOT0  (3 unrouted)
BT_DEV_WAKE  (1 unrouted)
BT_HOST_WAKE  (1 unrouted)
BT_REG_ON  (1 unrouted)
CC1  (1 unrouted)
CC2  (1 unrouted)
CHG  (1 unrouted)
CLK  (1 unrouted)
CMD  (1 unrouted)
DAT0  (1 unrouted)
DAT1  (1 unrouted)
DAT2  (1 unrouted)
DAT3  (1 unrouted)
DCMI_CLK  (1 unrouted)
DCMI_D0  (1 unrouted)
DCMI_D1  (1 unrouted)
DCMI_D2  (1 unrouted)
DCMI_D3  (1 unrouted)
DCMI_D4  (1 unrouted)
DCMI_D5  (1 unrouted)
DCMI_D6  (1 unrouted)
DCMI_D7  (1 unrouted)
DCMI_HSYNC  (1 unrouted)
DCMI_PCLK  (1 unrouted)
DCMI_PWDN  (2 unrouted)
DCMI_RST  (2 unrouted)
DCMI_VSYNC  (1 unrouted)
DN  (2 unrouted)
DP  (2 unrouted)
DRAM_A0  (1 unrouted)
DRAM_A1  (1 unrouted)
DRAM_A2  (1 unrouted)
DRAM_A3  (1 unrouted)
DRAM_A4  (1 unrouted)
DRAM_A5  (1 unrouted)
DRAM_A6  (1 unrouted)
DRAM_A7  (1 unrouted)
DRAM_A8  (1 unrouted)
DRAM_A9  (1 unrouted)
DRAM_A10  (1 unrouted)
DRAM_A11  (1 unrouted)
DRAM_BA0  (1 unrouted)
DRAM_BA1  (1 unrouted)
DRAM_CAS  (1 unrouted)
DRAM_CLK  (1 unrouted)
DRAM_CLKE  (1 unrouted)
DRAM_CS  (2 unrouted)
DRAM_D0  (1 unrouted)
DRAM_D1  (1 unrouted)
DRAM_D2  (1 unrouted)
DRAM_D3  (1 unrouted)
DRAM_D4  (1 unrouted)
DRAM_D5  (1 unrouted)
DRAM_D6  (1 unrouted)
DRAM_D7  (1 unrouted)
DRAM_D8  (1 unrouted)
DRAM_D9  (1 unrouted)
DRAM_D10  (1 unrouted)
DRAM_D11  (1 unrouted)
DRAM_D12  (1 unrouted)
DRAM_D13  (1 unrouted)
DRAM_D14  (1 unrouted)
DRAM_D15  (1 unrouted)
DRAM_D16  (1 unrouted)
DRAM_D17  (1 unrouted)
DRAM_D18  (1 unrouted)
DRAM_D19  (1 unrouted)
DRAM_D20  (1 unrouted)
DRAM_D21  (1 unrouted)
DRAM_D22  (1 unrouted)
DRAM_D23  (1 unrouted)
DRAM_D24  (1 unrouted)
DRAM_D25  (1 unrouted)
DRAM_D26  (1 unrouted)
DRAM_D27  (1 unrouted)
DRAM_D28  (1 unrouted)
DRAM_D29  (1 unrouted)
DRAM_D30  (1 unrouted)
DRAM_D31  (1 unrouted)
DRAM_DQM0  (1 unrouted)
DRAM_DQM1  (1 unrouted)
DRAM_DQM2  (1 unrouted)
DRAM_DQM3  (1 unrouted)
DRAM_RAS  (1 unrouted)
DRAM_WE  (1 unrouted)
FB  (2 unrouted)
FLASH_CLK  (1 unrouted)
FLASH_CS  (2 unrouted)
FLASH_IO0  (1 unrouted)
FLASH_IO1  (1 unrouted)
FLASH_IO2  (1 unrouted)
FLASH_IO3  (1 unrouted)
FSIN  (4 unrouted)
GND  (215 unrouted)
  pour GND (isolate 0.305): 0,0 0,44.45 35.56,44.45 35.56,0
I2C1_SCL  (2 unrouted)
I2C1_SDA  (2 unrouted)
I2C2_SCL  (2 unrouted)
I2C2_SDA  (2 unrouted)
I2C4_SCL  (4 unrouted)
I2C4_SDA  (4 unrouted)
I2C_RST  (2 unrouted)
ISET  (1 unrouted)
LED_B  (1 unrouted)
LED_B_INT  (1 unrouted)
LED_DRAIN  (2 unrouted)
LED_G  (1 unrouted)
LED_G_INT  (1 unrouted)
LED_IR  (2 unrouted)
LED_IR_DRIVE  (1 unrouted)
LED_IR_DRIVE_0  (1 unrouted)
LED_IR_DRIVE_1  (1 unrouted)
LED_IR_INT  (1 unrouted)
LED_R  (1 unrouted)
LED_R_INT  (1 unrouted)
LED_W_DRIVE  (2 unrouted)
LED_W_DRIVE_0  (1 unrouted)
LED_W_DRIVE_1  (1 unrouted)
N$1  (1 unrouted)
N$2  (1 unrouted)
N$3  (1 unrouted)
N$4  (1 unrouted)
N$5  (1 unrouted)
N$6  (1 unrouted)
N$7  (1 unrouted)
N$8  (1 unrouted)
N$9  (1 unrouted)
N$10  (1 unrouted)
N$11  (1 unrouted)
N$12  (1 unrouted)
NRST  (5 unrouted)
OSCEN  (2 unrouted)
OUT  (6 unrouted)
P9  (2 unrouted)
RAW  (4 unrouted)
RBIAS  (1 unrouted)
SD_CD  (2 unrouted)
SDIO_CLK  (1 unrouted)
SDIO_CMD  (1 unrouted)
SDIO_D0  (1 unrouted)
SDIO_D1  (1 unrouted)
SDIO_D2  (1 unrouted)
SDIO_D3  (1 unrouted)
SHIELD_INT  (4 unrouted)
SPI2_MISO  (2 unrouted)
SPI2_MOSI  (2 unrouted)
SPI2_NSS  (2 unrouted)
SPI2_SCLK  (2 unrouted)
SPI6_MISO  (1 unrouted)
SPI6_MOSI  (1 unrouted)
SPI6_SCLK  (1 unrouted)
SPI6_SSEL  (2 unrouted)
SR)VLX  (1 unrouted)
SW  (1 unrouted)
SWCLK  (2 unrouted)
SWDIO  (2 unrouted)
TIM3_CH1  (2 unrouted)
TIM3_CH2  (2 unrouted)
TS  (1 unrouted)
UART7_CTS  (1 unrouted)
UART7_RTS  (1 unrouted)
UART7_RX  (1 unrouted)
UART7_TX  (1 unrouted)
ULPI_CK  (1 unrouted)
ULPI_D0  (1 unrouted)
ULPI_D1  (1 unrouted)
ULPI_D2  (1 unrouted)
ULPI_D3  (1 unrouted)
ULPI_D4  (1 unrouted)
ULPI_D5  (1 unrouted)
ULPI_D6  (1 unrouted)
ULPI_D7  (1 unrouted)
ULPI_DIR  (1 unrouted)
ULPI_NXT  (1 unrouted)
ULPI_STP  (1 unrouted)
USB_DM  (1 unrouted)
USB_DP  (1 unrouted)
USBEN  (2 unrouted)
VBUS  (6 unrouted)
VBUS_INT  (6 unrouted)
VBUS_SENSE  (1 unrouted)
VCAP1  (1 unrouted)
VCAP2  (1 unrouted)
VCC  (135 unrouted)
  pour VCC (isolate 0.305): 0.38,0.38 0.38,44.07 35.18,44.07 35.18,0.38
VDDA  (4 unrouted)
VIN  (4 unrouted)
VIN_LDO  (3 unrouted)
WIFI_CLK  (1 unrouted)
WIFI_CMD  (2 unrouted)
WIFI_D0  (2 unrouted)
WIFI_D1  (2 unrouted)
WIFI_D2/SWO  (4 unrouted)
WIFI_D3  (2 unrouted)
WL_HOST_WAKE  (1 unrouted)
WL_REG_ON  (1 unrouted)

## Text on the board
tPlace: P0 | RST | P1 | BT0 | P2 | P10 | P3 | P9 | P4 | P8 | P5 | P7 | P6 | VBUS | GND | VIN | 3.3V | GND
bPlace: IR | W | P0 | RST | P1 | BT0 | P2 | P10 | VIN Max / Voltage: 5v | P3 | OpenMV4-PRO R1 | P9 | P4 | P8 | 12/28/2021 | P5 | P7 | P6 | VBUS | GND | VIN | 3.3V | GND